# Altium project ControlBoard.PrjPcb (part 2 of 3)

## Sheet Analogicas_Tension.SchDoc: Analogicas Tension
size A3; CompanyName: TM; DrawnBy: Juan Tinazzo; Revision: R8; SheetNumber: 4; SheetTotal: 7; Number: CB_AT; Company: TM
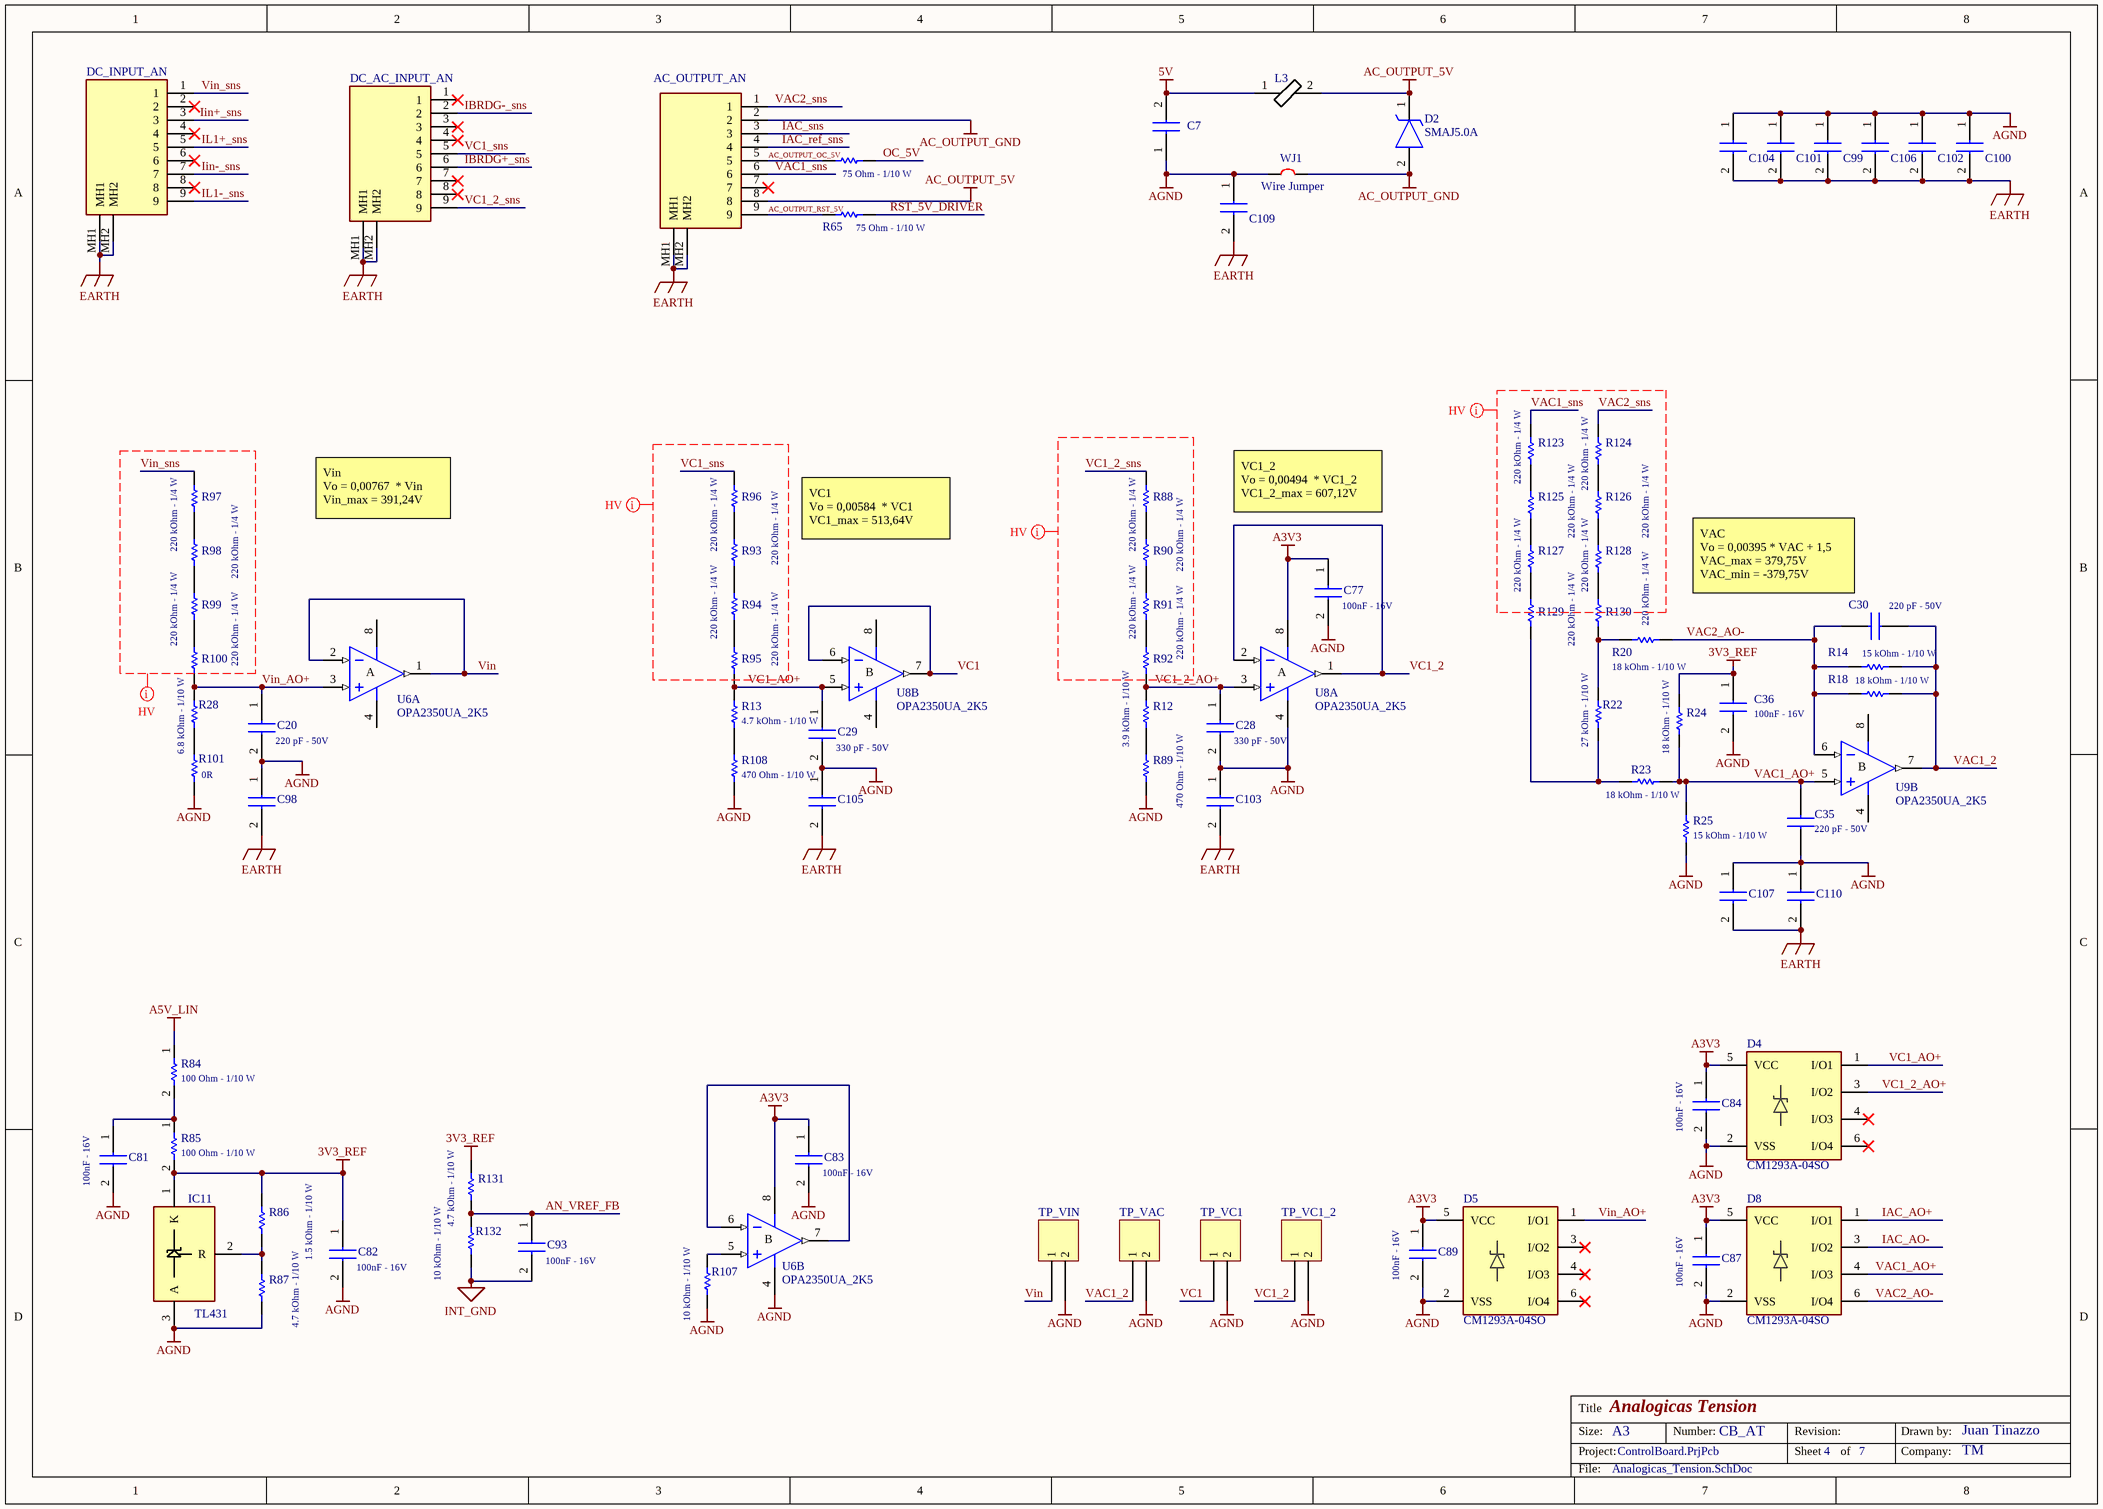
[diagram p3: Analogicas_Tension.SchDoc]

### Parts
AC_OUTPUT_AN  L77TSEH09SOL2RM8  [L77TSEH09SOL2RM8]  (value not drawn)
C7  CL21B105KAFNNNG  [CAPC2012X135N]  (value not drawn)
C20  value 220 pF - 50V  [C0603]  (hidden comment: 220p 50V 5% 0603)
C28  value 330 pF - 50V  [C0603]  (hidden comment: C0603C331J5GACAUTO)
C29  value 330 pF - 50V  [C0603]  (hidden comment: C0603C331J5GACAUTO)
C30  value 220 pF - 50V  [C0603]  (hidden comment: C0603C221J5HACAUTO)
C35  value 220 pF - 50V  [C0603]  (hidden comment: C0603C221J5HACAUTO)
C36  value 100nF - 16V  [CAPC1608X95N]  (hidden comment: 100n 16V 0603)
C77  value 100nF - 16V  [CAPC1608X95N]  (hidden comment: 100n 16V 0603)
C81  value 100nF - 16V  [CAPC1608X95N]  (hidden comment: 100n 16V 0603)
C82  value 100nF - 16V  [CAPC1608X95N]  (hidden comment: 100n 16V 0603)
C83  value 100nF - 16V  [CAPC1608X95N]  (hidden comment: 100n 16V 0603)
C84  value 100nF - 16V  [CAPC1608X95N]  (hidden comment: 100n 16V 0603)
C87  value 100nF - 16V  [CAPC1608X95N]  (hidden comment: 100n 16V 0603)
C89  value 100nF - 16V  [CAPC1608X95N]  (hidden comment: 100n 16V 0603)
C93  value 100nF - 16V  [CAPC1608X95N]  (hidden comment: 100n 16V 0603)
C98  LDEQD1100KA5N00  [C_2220_1206]  (value not drawn)
C99  C1206C102KGRACAUTO  [C1206]  (value not drawn)
C100  C1206C102KGRACAUTO  [C1206]  (value not drawn)
C101  C1206C102KGRACAUTO  [C1206]  (value not drawn)
C102  C1206C102KGRACAUTO  [C1206]  (value not drawn)
C103  LDEQD1100KA5N00  [C_2220_1206]  (value not drawn)
C104  C1206C102KGRACAUTO  [C1206]  (value not drawn)
C105  LDEQD1100KA5N00  [C_2220_1206]  (value not drawn)
C106  C1206C102KGRACAUTO  [C1206]  (value not drawn)
C107  LDEQD1100KA5N00  [C_2220_1206]  (value not drawn)
C109  LDEQD1100KA5N00  [C_2220_1206]  (value not drawn)
C110  LDEQD1100KA5N00  [C_2220_1206]  (value not drawn)
D2  SMAJ5.0A  [DIOM5026X229N]
D4  CM1293A-04SO  [SOT95P275X110-6N]
D5  CM1293A-04SO  [SOT95P275X110-6N]
D8  CM1293A-04SO  [SOT95P275X110-6N]
DC_AC_INPUT_AN  L77TSEH09SOL2RM8  [L77TSEH09SOL2RM8]  (value not drawn)
DC_INPUT_AN  L77TSEH09SOL2RM8  [L77TSEH09SOL2RM8]  (value not drawn)
IC11  TL431  [SOT95P237X112-3N]
L3  78279220601  [BEADC2012X110N]  (value not drawn)
R12  value 3.9 kOhm - 1/10 W  [RESC1608X50N]  (hidden comment: CRCW06033K90FKEA)
R13  value 4.7 kOhm - 1/10 W  [RESC1608X50N]  (hidden comment: CRCW06034K70FKEAHP)
R14  value 15 kOhm - 1/10 W  [RESC1608X55N]  (hidden comment: CRCW060315K0FKEAC)
R18  value 18 kOhm - 1/10 W  [RESC1608X50N]  (hidden comment: CRCW060318K0FKEA)
R20  value 18 kOhm - 1/10 W  [RESC1608X50N]  (hidden comment: CRCW060318K0FKEA)
R22  value 27 kOhm - 1/10 W  [RESC1608X55N]  (hidden comment: CRCW060327K0FKEAC)
R23  value 18 kOhm - 1/10 W  [RESC1608X50N]  (hidden comment: CRCW060318K0FKEA)
R24  value 18 kOhm - 1/10 W  [RESC1608X50N]  (hidden comment: CRCW060318K0FKEA)
R25  value 15 kOhm - 1/10 W  [RESC1608X55N]  (hidden comment: CRCW060315K0FKEAC)
R28  value 6.8 kOhm - 1/10 W  [RESC1608X50N]  (hidden comment: CRCW06036K80FKEA)
R62  value 75 Ohm - 1/10 W  [RESC1608X55N]  (hidden comment: CRCW060375R0FKEAC)
R65  value 75 Ohm - 1/10 W  [RESC1608X55N]  (hidden comment: CRCW060375R0FKEAC)
R84  value 100 Ohm - 1/10 W  [RESC1608X55N]  (hidden comment: CRCW0603100RFKEBC)
R85  value 100 Ohm - 1/10 W  [RESC1608X55N]  (hidden comment: CRCW0603100RFKEBC)
R86  value 1.5 kOhm - 1/10 W  [RESC1608X50N]  (hidden comment: CRCW06031K50FKEA)
R87  value 4.7 kOhm - 1/10 W  [RESC1608X50N]  (hidden comment: CRCW06034K70FKEAHP)
R88  value 220 kOhm - 1/4 W  [RESC3216X60N]  (hidden comment: CRCW1206220KFKEA)
R89  value 470 Ohm - 1/10 W  [RESC1608X50N]  (hidden comment: CRCW0603470RFKEA)
R90  value 220 kOhm - 1/4 W  [RESC3216X60N]  (hidden comment: CRCW1206220KFKEA)
R91  value 220 kOhm - 1/4 W  [RESC3216X60N]  (hidden comment: CRCW1206220KFKEA)
R92  value 220 kOhm - 1/4 W  [RESC3216X60N]  (hidden comment: CRCW1206220KFKEA)
R93  value 220 kOhm - 1/4 W  [RESC3216X60N]  (hidden comment: CRCW1206220KFKEA)
R94  value 220 kOhm - 1/4 W  [RESC3216X60N]  (hidden comment: CRCW1206220KFKEA)
R95  value 220 kOhm - 1/4 W  [RESC3216X60N]  (hidden comment: CRCW1206220KFKEA)
R96  value 220 kOhm - 1/4 W  [RESC3216X60N]  (hidden comment: CRCW1206220KFKEA)
R97  value 220 kOhm - 1/4 W  [RESC3216X60N]  (hidden comment: CRCW1206220KFKEA)
R98  value 220 kOhm - 1/4 W  [RESC3216X60N]  (hidden comment: CRCW1206220KFKEA)
R99  value 220 kOhm - 1/4 W  [RESC3216X60N]  (hidden comment: CRCW1206220KFKEA)
R100  value 220 kOhm - 1/4 W  [RESC3216X60N]  (hidden comment: CRCW1206220KFKEA)
R101  value 0R  [RESC1608X55N]  (hidden comment: CRCW06030000Z0EBC)
R107  value 10 kOhm - 1/10 W  [RESC1608X50N]  (hidden comment: CRCW060310K0FKEA)
R108  value 470 Ohm - 1/10 W  [RESC1608X50N]  (hidden comment: CRCW0603470RFKEA)
R123  value 220 kOhm - 1/4 W  [RESC3216X60N]  (hidden comment: CRCW1206220KFKEA)
R124  value 220 kOhm - 1/4 W  [RESC3216X60N]  (hidden comment: CRCW1206220KFKEA)
R125  value 220 kOhm - 1/4 W  [RESC3216X60N]  (hidden comment: CRCW1206220KFKEA)
R126  value 220 kOhm - 1/4 W  [RESC3216X60N]  (hidden comment: CRCW1206220KFKEA)
R127  value 220 kOhm - 1/4 W  [RESC3216X60N]  (hidden comment: CRCW1206220KFKEA)
R128  value 220 kOhm - 1/4 W  [RESC3216X60N]  (hidden comment: CRCW1206220KFKEA)
R129  value 220 kOhm - 1/4 W  [RESC3216X60N]  (hidden comment: CRCW1206220KFKEA)
R130  value 220 kOhm - 1/4 W  [RESC3216X60N]  (hidden comment: CRCW1206220KFKEA)
R131  value 4.7 kOhm - 1/10 W  [RESC1608X50N]  (hidden comment: CRCW06034K70FKEAHP)
R132  value 10 kOhm - 1/10 W  [RESC1608X50N]  (hidden comment: CRCW060310K0FKEA)
TP_VAC  Test_Point  [Test Point]  (value not drawn)
TP_VC1  Test_Point  [Test Point]  (value not drawn)
TP_VC1_2  Test_Point  [Test Point]  (value not drawn)
TP_VIN  Test_Point  [Test Point]  (value not drawn)
U6  OPA2350UA_2K5  [SOIC127P600X175-8N]  (parts A,B of 2)
U8  OPA2350UA_2K5  [SOIC127P600X175-8N]  (parts A,B of 2)
U9  OPA2350UA_2K5  [SOIC127P600X175-8N]  (part B of 2)
WJ1  Wire Jumper  (net tie, no BOM)

### Nets
3V3_REF: C36.1 C82.1 IC11.1(K) R24.2 R85.2 R86.1 R131.1
5V: C7.2 L3.1
A3V3: C77.1 C83.1 C84.1 C87.1 C89.1 D4.5(VCC) D5.5(VCC) D8.5(VCC) U6.8(V+) U8.8(V+) U9.8(V+)
A5V_LIN: R84.1
AC_OUTPUT_5V: AC_OUTPUT_AN.8 D2.1(K) L3.2
AC_OUTPUT_GND: AC_OUTPUT_AN.2 D2.2(A) WJ1.1
AGND: C7.1 C20.2 C28.2 C29.2 C35.2 C36.2 C77.2 C81.2 C82.2 C83.2 C84.2 C87.2 C89.2 C93.2 C98.1 C99.1 C100.1 C101.1 C102.1 C103.1 C104.1 C105.1 C106.1 C107.1 C109.1 C110.1 D4.2(VSS) D5.2(VSS) D8.2(VSS) IC11.3(A) R25.2 R87.2 R89.2 R101.1 R107.1 R108.2 R132.2 TP_VAC.2 TP_VC1.2 TP_VC1_2.2 TP_VIN.2 U6.4(V-) U8.4(V-) U9.4(V-) WJ1.0  [also labelled INT_GND]
EARTH: AC_OUTPUT_AN.MH1 AC_OUTPUT_AN.MH2 C98.2 C99.2 C100.2 C101.2 C102.2 C103.2 C104.2 C105.2 C106.2 C107.2 C109.2 C110.2 DC_AC_INPUT_AN.MH1 DC_AC_INPUT_AN.MH2 DC_INPUT_AN.MH1 DC_INPUT_AN.MH2
AC_OUTPUT_OC_5V: AC_OUTPUT_AN.5 R62.1
AC_OUTPUT_RST_5V: AC_OUTPUT_AN.9 R65.1
AN_VREF_FB: C93.1 R131.2 R132.1
IAC_AO+: D8.1(I/O1)
IAC_AO-: D8.3(I/O2)
IAC_ref_sns: AC_OUTPUT_AN.4
IAC_sns: AC_OUTPUT_AN.3
IBRDG+_sns: DC_AC_INPUT_AN.6
IBRDG-_sns: DC_AC_INPUT_AN.2
Iin+_sns: DC_INPUT_AN.3
Iin-_sns: DC_INPUT_AN.7
IL1+_sns: DC_INPUT_AN.5
IL1-_sns: DC_INPUT_AN.9
OC_5V: R62.2
RST_5V_DRIVER: R65.2
VAC1_2: C30.1 R14.2 R18.2 TP_VAC.1 U9.7(OUT)
VAC1_AO+: C35.1 D8.4(I/O3) R23.1 R24.1 R25.1 U9.5(IN+)
VAC1_sns: AC_OUTPUT_AN.6 R123.2
VAC2_AO-: C30.2 D8.6(I/O4) R14.1 R18.1 R20.1 U9.6(IN-)
VAC2_sns: AC_OUTPUT_AN.1 R124.2
VC1: TP_VC1.1 U8.6(IN-) U8.7(OUT)
VC1_2: TP_VC1_2.1 U8.1(OUT) U8.2(IN-)
VC1_2_AO+: C28.1 D4.3(I/O2) R12.2 R92.1 U8.3(IN+)
VC1_2_sns: DC_AC_INPUT_AN.9 R88.2
VC1_AO+: C29.1 D4.1(I/O1) R13.2 R95.1 U8.5(IN+)
VC1_sns: DC_AC_INPUT_AN.5 R96.2
Vin: TP_VIN.1 U6.1(OUT) U6.2(IN-)
Vin_AO+: C20.1 D5.1(I/O1) R28.2 R100.1 U6.3(IN+)
Vin_sns: DC_INPUT_AN.1 R97.2
NetC81_1: C81.1 R84.2 R85.1
NetIC11_2: IC11.2(R) R86.2 R87.1
NetR12_1: R12.1 R89.1
NetR13_1: R13.1 R108.1
NetR20_2: R20.2 R22.2 R130.1
NetR22_1: R22.1 R23.2 R129.1
NetR28_1: R28.1 R101.2
NetR88_1: R88.1 R90.2
NetR90_1: R90.1 R91.2
NetR91_1: R91.1 R92.2
NetR93_1: R93.1 R94.2
NetR93_2: R93.2 R96.1
NetR94_1: R94.1 R95.2
NetR97_1: R97.1 R98.2
NetR98_1: R98.1 R99.2
NetR99_1: R99.1 R100.2
NetR107_2: R107.2 U6.5(IN+)
NetR123_1: R123.1 R125.2
NetR124_1: R124.1 R126.2
NetR125_1: R125.1 R127.2
NetR126_1: R126.1 R128.2
NetR127_1: R127.1 R129.2
NetR128_1: R128.1 R130.2
NetU6_6: U6.6(IN-) U6.7(OUT)

Not connected (* = marked no-connect by the designer): AC_OUTPUT_AN 7*; D4 4(I/O3)* 6(I/O4)*; D5 3(I/O2)* 4(I/O3)* 6(I/O4)*; DC_AC_INPUT_AN 1* 3* 4* 7* 8*; DC_INPUT_AN 2* 4* 6* 8*

### Layout directives
net class HV_track: VAC1_sns, VAC2_sns, VC1_2_sns, VC1_sns, Vin_sns

### Notes on the sheet
- Vin
  Vo = 0,00767  * Vin
  Vin_max = 391,24V
- VC1_2
  Vo = 0,00494  * VC1_2
  VC1_2_max = 607,12V
- VC1
  Vo = 0,00584  * VC1
  VC1_max = 513,64V
- VAC
  Vo = 0,00395 * VAC + 1,5
  VAC_max = 379,75V
  VAC_min = -379,75V
- Title
- Size:
- Project:
- A3
- Number:
- Revision:
- Sheet
- of
- Drawn by:
- Company:
- File:
- (in symbol OPA2350UA_2K5, part A) A
- (in symbol OPA2350UA_2K5, part B) B

### Library data of the parts
AC_OUTPUT_AN DC_AC_INPUT_AN DC_INPUT_AN = L77TSEH09SOL2RM8: Connector; Manufacturer_Name: Amphenol Communications Solutions; Value: Conectores estándar subminiatura D D-SUB; Datasheet Link: https://cdn.amphenol-cs.com/media/wysiwyg/files/drawing/l77tsxhxxsol2rm8.pdf; Height: 12.3mm; Manufacturer_Part_Number: L77TSEH09SOL2RM8; Mouser Part Number: 523-L77TSEH09SOL2RM8; Mouser Price/Stock: https://www.mouser.co.uk/ProductDetail/Amphenol-Commercial-Products/L77TSEH09SOL2RM8?qs=mq7kV%2Fq8lk5RvjourI%2Fduw%3D%3D; Arrow Part Number: L77TSEH09SOL2RM8; Arrow Price/Stock: https://www.arrow.com/en/products/l77tseh09sol2rm8/amphenol-fci?region=nac; System: Connector
C7 = CL21B105KAFNNNG: Capacitor; Manufacturer_Name: SAMSUNG; Value: 1 uF - 25 V; Datasheet Link: https://datasheet.datasheetarchive.com/originals/distributors/Datasheets-DGA8/2478773.pdf; Height: 1.35mm; Manufacturer_Part_Number: CL21B105KAFNNNG; Mouser Part Number: 187-CL21B105KAFNNNG; Mouser Price/Stock: https://www.mouser.co.uk/ProductDetail/Samsung-Electro-Mechanics/CL21B105KAFNNNG?qs=yOVawPpwOwmXkU%252BG0TK%2F5g%3D%3D; Arrow Part Number: CL21B105KAFNNNG; Arrow Price/Stock: https://www.arrow.com/en/products/cl21b105kafnnng/samsung-electro-mechanics?region=europe
C20 C30 C35 = C0603C221J5HACAUTO: Capacitor; Manufacturer_Name: KEMET; Datasheet Link: https://content.kemet.com/datasheets/KEM_C1007_X8R_ULTRA_150C_SMD.pdf; Height: 0.87mm; Manufacturer_Part_Number: C0603C221J5HACAUTO; Mouser Part Number: 80-C0603C221J5HAUTO; Mouser Price/Stock: https://www.mouser.co.uk/ProductDetail/KEMET/C0603C221J5HACAUTO?qs=j%252B1pi9TdxUZayjzZ3rh80g%3D%3D
C28 C29 = C0603C331J5GACAUTO: Capacitor; Manufacturer_Name: KEMET; Datasheet Link: https://content.kemet.com/datasheets/KEM_C1022_C0G_AUTO_SMD.pdf; Height: 0.87mm; Manufacturer_Part_Number: C0603C331J5GACAUTO; Mouser Part Number: 80-C0603C331J5GAUTO
C36 C77 C81-C84 C87 C89 C93 = EMK107B7104KA-T: Capacitor; Manufacturer_Name: TAIYO YUDEN; Datasheet Link: http://www.farnell.com/datasheets/746258.pdf; Height: 0.95mm; Manufacturer_Part_Number: EMK107B7104KA-T; Mouser Part Number: 963-EMK107B7104KA-T; Arrow Part Number: EMK107B7104KA-T; Arrow Price/Stock: https://www.arrow.com/en/products/emk107b7104ka-t/taiyo-yuden
  C36: Mouser Price/Stock: https://www.mouser.co.uk/ProductDetail/TAIYO-YUDEN/EMK107B7104KA-T?qs=I6KAKw0tg2ybqzX8hKPgfw%3D%3D
  C77 C81-C84 C87 C89 C93: Mouser Price/Stock: https://www.mouser.co.uk/ProductDetail/Taiyo-Yuden/EMK107B7104KA-T?qs=I6KAKw0tg2ybqzX8hKPgfw%3D%3D
C98 C103 C105 C107 C109 C110 = LDEQD1100KA5N00: Capacitor; Manufacturer_Name: KEMET; Value: 1nF - 1000V; Datasheet Link: https://content.kemet.com/datasheets/KEM_F3078_LDE.pdf; Height: 1.9mm; Manufacturer_Part_Number: LDEQD1100KA5N00; Mouser Part Number: 80-LDEQD1100KA5N00; Mouser Price/Stock: https://www.mouser.co.uk/ProductDetail/KEMET/LDEQD1100KA5N00?qs=MdJgNetHbfkxq2yA6XdGCw%3D%3D
C99-C102 C104 C106 = C1206C102KGRACAUTO: Capacitor; Manufacturer_Name: KEMET; Value: 1nF - 2000V; Datasheet Link: https://content.kemet.com/datasheets/KEM_C1076_X7R_HV_AUTO_SMD.pdf; Manufacturer_Part_Number: C1206C102KGRACAUTO; Mouser Part Number: 80-C1206C102KGRAUTO; Mouser Price/Stock: https://www.mouser.co.uk/ProductDetail/KEMET/C1206C102KGRACAUTO?qs=02kMkzikyGKenJNcwYLRQw%3D%3D; Arrow Part Number: C1206C102KGRACAUTO; Arrow Price/Stock: https://www.arrow.com/en/products/c1206c102kgracauto/kemet-corporation?region=nac
D2 = SMAJ5.0A: TVS Diode (Uni-directional); Manufacturer_Name: LITTELFUSE; Value: 1CH - Unidireccional - 5V - 3.3 W; Datasheet Link: https://www.littelfuse.com/~/media/electronics/datasheets/tvs_diodes/littelfuse_tvs_diode_smaj_datasheet.pdf.pdf; Height: 2.29mm; Manufacturer_Part_Number: SMAJ5.0A; Mouser Part Number: 576-SMAJ5.0A; Mouser Price/Stock: https://www.mouser.co.uk/ProductDetail/Littelfuse/SMAJ5.0A?qs=2VFNtWizgicfetZVA4gWHA%3D%3D; Arrow Part Number: SMAJ5.0A; Arrow Price/Stock: https://www.arrow.com/en/products/smaj5.0a/littelfuse?region=europe
D4 D5 D8 = CM1293A-04SO: TVS Diode (Bi-directional); Manufacturer_Name: onsemi; Manufacturer_Part_Number: D5V0P4UR6SO-7; Value: 4CH - Unidireccional - 3.3V - 800mW; Datasheet Link: https://www.onsemi.com/pub/Collateral/CM1293A-04SO-D.PDF; Height: 1.1mm; Mouser Part Number: 748-CM1293A-04SO; Mouser Price/Stock: https://www.mouser.co.uk/ProductDetail/onsemi/CM1293A-04SO?qs=LMMkZCEv%2Ff0mlcOKTEwKBg%3D%3D; Arrow Part Number: CM1293A-04SO; Arrow Price/Stock: https://www.arrow.com/en/products/cm1293a-04so/on-semiconductor?region=nac
IC11 = TL431LIBEDBZRQ1: Integrated Circuit; Manufacturer_Name: Texas Instruments; Value: Referencias de voltaje; Datasheet Link: https://www.ti.com/lit/gpn/TL431LI-Q1; Height: 1.12mm; Manufacturer_Part_Number: TL431LIBEDBZRQ1; Mouser Part Number: 595-TL431LIBEDBZRQ1; Mouser Price/Stock: https://www.mouser.co.uk/ProductDetail/Texas-Instruments/TL431LIBEDBZRQ1?qs=Cb2nCFKsA8oDEduucTTYNA%3D%3D; Arrow Part Number: TL431LIBEDBZRQ1; Arrow Price/Stock: https://www.arrow.com/en/products/tl431libedbzrq1/texas-instruments?region=nac
L3 = 78279220601: Ferrite Bead; Manufacturer_Name: Wurth Elektronik; Value: Núcleos de ferrita WE-MPSA EMI 600Ohms 2.1A 80mOhms; Datasheet Link: https://www.mouser.de/datasheet/2/445/78279220601-2298574.pdf; Height: 1.1mm; Manufacturer_Part_Number: 78279220601; Mouser Part Number: 710-78279220601; Mouser Price/Stock: https://www.mouser.co.uk/ProductDetail/Wurth-Elektronik/78279220601?qs=iLbezkQI%252BsjgiK1FovJqGg%3D%3D
R12 = CRCW06033K90FKEA: Resistor; Manufacturer_Name: Vishay; Datasheet Link: http://www.vishay.com/docs/20035/dcrcwe3.pdf; Height: 0.5mm; Manufacturer_Part_Number: CRCW06033K90FKEA; Mouser Part Number: 71-CRCW0603-3.9K-E3; Mouser Price/Stock: https://www.mouser.com/Search/Refine.aspx?Keyword=71-CRCW0603-3.9K-E3; Arrow Part Number: CRCW06033K90FKEA; Arrow Price/Stock: https://www.arrow.com/en/products/crcw06033k90fkea/vishay
R13 R87 R131 = CRCW06034K70FKEAHP: Resistor; Manufacturer_Name: Vishay; Datasheet Link: http://www.farnell.com/datasheets/1885357.pdf; Height: 0.5mm; Manufacturer_Part_Number: CRCW06034K70FKEAHP; Mouser Part Number: 71-CRCW06034K70FKEAH; Mouser Price/Stock: https://www.mouser.co.uk/ProductDetail/Vishay-Dale/CRCW06034K70FKEAHP?qs=k2%2FDWSARqgF9tclCHvhGkQ%3D%3D; Arrow Part Number: CRCW06034K70FKEAHP; Arrow Price/Stock: https://www.arrow.com/en/products/crcw06034k70fkeahp/vishay?region=nac
R14 R25 = CRCW060315K0FKEAC: Resistor; Manufacturer_Name: Vishay; Datasheet Link: https://www.arrow.com/en/products/crcw060315k0fkeac/vishay; Height: 0.55mm; Manufacturer_Part_Number: CRCW060315K0FKEAC; Mouser Part Number: 71-CRCW060315K0FKEAC; Mouser Price/Stock: https://www.mouser.co.uk/ProductDetail/Vishay-Dale/CRCW060315K0FKEAC?qs=E3Y5ESvWgWOCeZLgjE8pIw%3D%3D; Arrow Part Number: CRCW060315K0FKEAC; Arrow Price/Stock: https://www.arrow.com/en/products/crcw060315k0fkeac/vishay?region=nac
R18 R20 R23 R24 = CRCW060318K0FKEA: Resistor; Manufacturer_Name: Vishay; Datasheet Link: http://www.vishay.com/docs/20035/dcrcwe3.pdf; Height: 0.5mm; Manufacturer_Part_Number: CRCW060318K0FKEA; Mouser Part Number: 71-CRCW0603-18K-E3; Mouser Price/Stock: https://www.mouser.co.uk/ProductDetail/Vishay-Dale/CRCW060318K0FKEA?qs=Ihd9YkxhV%2F2Qiuqr%2FyuzaQ%3D%3D; Arrow Part Number: CRCW060318K0FKEA; Arrow Price/Stock: https://www.arrow.com/en/products/crcw060318k0fkea/vishay?region=nac
R22 = CRCW060327K0FKEAC: Resistor; Manufacturer_Name: Vishay; Datasheet Link: https://www.arrow.com/en/products/crcw060327k0fkeac/vishay; Height: 0.55mm; Manufacturer_Part_Number: CRCW060327K0FKEAC; Mouser Part Number: 71-CRCW060327K0FKEAC; Mouser Price/Stock: https://www.mouser.co.uk/ProductDetail/Vishay-Dale/CRCW060327K0FKEAC?qs=E3Y5ESvWgWP9bkV7w8gJXg%3D%3D; Arrow Part Number: CRCW060327K0FKEAC; Arrow Price/Stock: https://www.arrow.com/en/products/crcw060327k0fkeac/vishay?region=nac
R28 = CRCW06036K80FKEA: Resistor; Manufacturer_Name: Vishay; Datasheet Link: http://www.vishay.com/docs/20035/dcrcwe3.pdf; Height: 0.5mm; Manufacturer_Part_Number: CRCW06036K80FKEA; Mouser Part Number: 71-CRCW0603-6.8K-E3; Mouser Price/Stock: https://www.mouser.co.uk/ProductDetail/Vishay-Dale/CRCW06036K80FKEA?qs=AJ8X0UdFcuT%2FTCHOUTZCrw%3D%3D; Arrow Part Number: CRCW06036K80FKEA; Arrow Price/Stock: https://www.arrow.com/en/products/crcw06036k80fkea/vishay
R62 R65 = CRCW060375R0FKEAC: Resistor; Manufacturer_Name: Vishay; Datasheet Link: https://www.arrow.com/en/products/crcw060375r0fkeac/vishay; Height: 0.55mm; Manufacturer_Part_Number: CRCW060375R0FKEAC; Mouser Part Number: 71-CRCW060375R0FKEAC; Mouser Price/Stock: https://www.mouser.co.uk/ProductDetail/Vishay-Dale/CRCW060375R0FKEAC?qs=E3Y5ESvWgWPOxF9wqCfv4A%3D%3D; Arrow Part Number: CRCW060375R0FKEAC; Arrow Price/Stock: https://www.arrow.com/en/products/crcw060375r0fkeac/vishay?region=nac
R84 R85 = CRCW0603100RFKEBC: Resistor; Manufacturer_Name: Vishay; Datasheet Link: https://www.vishay.com/docs/28773/crcwce3.pdf; Height: 0.55mm; Manufacturer_Part_Number: CRCW0603100RFKEBC; Mouser Part Number: 71-CRCW0603100RFKEBC; Mouser Price/Stock: https://www.mouser.co.uk/ProductDetail/Vishay-Dale/CRCW0603100RFKEBC?qs=wd5RIQLrsJhdvQFtBw4oWg%3D%3D; Arrow Part Number: CRCW0603100RFKEBC; Arrow Price/Stock: https://www.arrow.com/en/products/crcw0603100rfkebc/vishay?region=nac
R86 = CRCW06031K50FKEA: Resistor; Manufacturer_Name: Vishay; Datasheet Link: http://www.vishay.com/docs/20035/dcrcwe3.pdf; Height: 0.5mm; Manufacturer_Part_Number: CRCW06031K50FKEA; Mouser Part Number: 71-CRCW0603-1.5K-E3; Mouser Price/Stock: https://www.mouser.co.uk/ProductDetail/Vishay-Dale/CRCW06031K50FKEA?qs=TPnjyyNsHsazZOiw0hmO4g%3D%3D; Arrow Part Number: CRCW06031K50FKEA; Arrow Price/Stock: https://www.arrow.com/en/products/crcw06031k50fkea/vishay?region=nac
R88 R90-R100 R123-R130 = CRCW1206220KFKEA: Resistor; Manufacturer_Name: Vishay; Datasheet Link: http://www.vishay.com/docs/20035/dcrcwe3.pdf; Height: 0.6mm; Manufacturer_Part_Number: CRCW1206220KFKEA; Mouser Part Number: 71-CRCW1206-220K-E3; Mouser Price/Stock: https://www.mouser.co.uk/ProductDetail/Vishay-Dale/CRCW1206220KFKEA?qs=bSMkur10BccuQYiNrhxgBA%3D%3D
R89 R108 = CRCW0603470RFKEA: Resistor; Manufacturer_Name: Vishay; Datasheet Link: http://www.vishay.com/docs/20035/dcrcwe3.pdf; Height: 0.5mm; Manufacturer_Part_Number: CRCW0603470RFKEA; Mouser Part Number: 71-CRCW0603-470-E3; Mouser Price/Stock: https://www.mouser.co.uk/ProductDetail/Vishay-Dale/CRCW0603470RFKEA?qs=2LLIXXYaQepTa3IToKeExA%3D%3D; Arrow Part Number: CRCW0603470RFKEA; Arrow Price/Stock: https://www.arrow.com/en/products/crcw0603470rfkea/vishay
R101 = CRCW06030000Z0EBC: Resistor; Manufacturer_Name: Vishay; Datasheet Link: https://datasheet.datasheetarchive.com/originals/distributors/DKDS41/DSANUWW0030149.pdf; Height: 0.55mm; Manufacturer_Part_Number: CRCW06030000Z0EBC; Mouser Part Number: 71-CRCW06030000Z0EBC; Mouser Price/Stock: https://www.mouser.co.uk/ProductDetail/Vishay-Dale/CRCW06030000Z0EBC?qs=wd5RIQLrsJgQzOqdcVum5Q%3D%3D; Arrow Part Number: CRCW06030000Z0EBC; Arrow Price/Stock: https://www.arrow.com/en/products/crcw06030000z0ebc/vishay?region=nac
R107 R132 = CRCW060310K0FKEA: Resistor; Manufacturer_Name: Vishay; Datasheet Link: http://www.vishay.com/docs/20035/dcrcwe3.pdf; Height: 0.5mm; Manufacturer_Part_Number: CRCW060310K0FKEA; Mouser Part Number: 71-CRCW0603-10K-E3; Mouser Price/Stock: https://www.mouser.co.uk/ProductDetail/Vishay-Dale/CRCW060310K0FKEA?qs=pAO1Z172M84BVnhDjtnsoQ%3D%3D; Arrow Part Number: CRCW060310K0FKEA; Arrow Price/Stock: https://www.arrow.com/en/products/crcw060310k0fkea/vishay?region=nac
TP_VAC TP_VC1 TP_VC1_2 TP_VIN = Test_Point: Punta Prueba Osciloscopio; Manufacturer_Part_Number: PCB; Value: TP
U6 U8 U9 = OPA2350UA_2K5: Integrated Circuit; Manufacturer_Name: Texas Instruments; Manufacturer_Part_Number: OPA2350UA/2K5; Value: AO de alta velocidad, fuente unica, rail to rail; Datasheet Link: http://www.ti.com/lit/gpn/opa2350; Height: 1.75mm; Mouser Part Number: 595-OPA2350UA/2K5; Mouser Price/Stock: https://www.mouser.co.uk/ProductDetail/Texas-Instruments/OPA2350UA-2K5?qs=7nS3%252BbEUL6t75JUF5jEhbw%3D%3D; Arrow Part Number: OPA2350UA/2K5; Arrow Price/Stock: https://www.arrow.com/en/products/opa2350ua2k5/texas-instruments?region=nac
WJ1 = Wire Jumper: Manufacturer_Part_Number: Wire

## Sheet Analogicas_Corriente.SchDoc: Analogicas Corriente
size A3; CompanyName: TM; DrawnBy: Juan Tinazzo; Revision: R8; SheetNumber: 5; SheetTotal: 7; Number: CB_AC; Company: TM
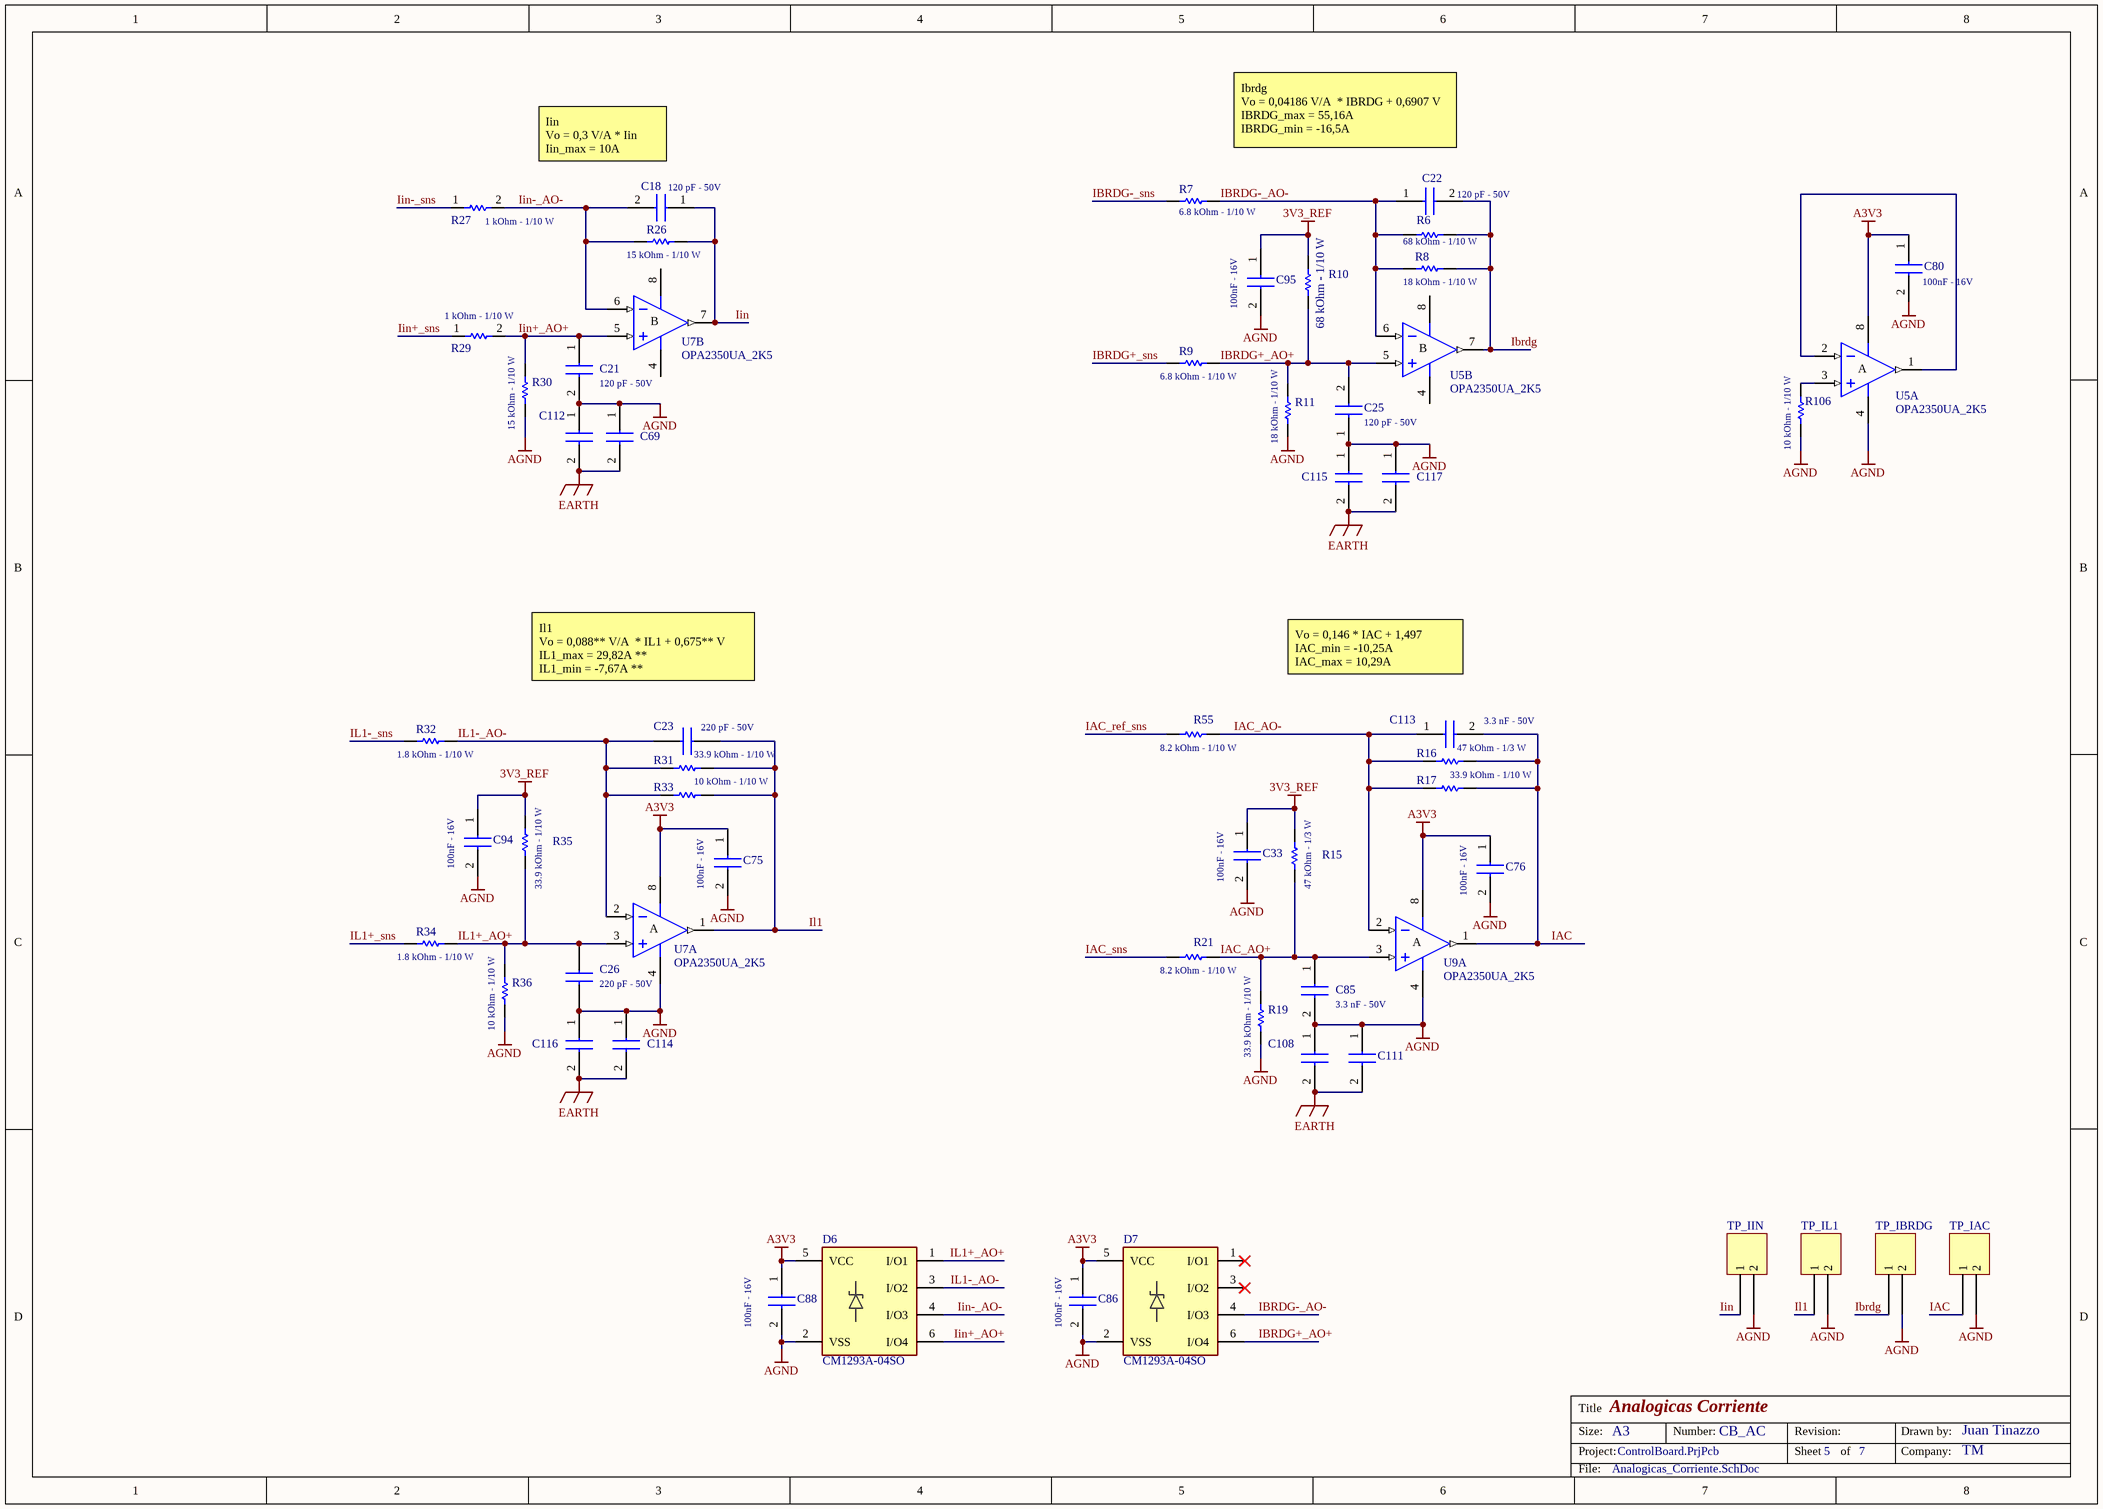
[diagram p4: Analogicas_Corriente.SchDoc]

### Parts
C18  value 120 pF - 50V  [C0603]  (hidden comment: 120p)
C21  value 120 pF - 50V  [C0603]  (hidden comment: C0603C121J5GAC7411)
C22  value 120 pF - 50V  [C0603]  (hidden comment: C0603C121J5GAC7411)
C23  value 220 pF - 50V  [C0603]  (hidden comment: 220p)
C25  value 120 pF - 50V  [C0603]  (hidden comment: C0603C121J5GAC7411)
C26  value 220 pF - 50V  [C0603]  (hidden comment: 220p)
C33  value 100nF - 16V  [CAPC1608X95N]  (hidden comment: 100n 16V 0603)
C69  C1206C102KGRACAUTO  [C1206]  (value not drawn)
C75  value 100nF - 16V  [CAPC1608X95N]  (hidden comment: 100n 16V 0603)
C76  value 100nF - 16V  [CAPC1608X95N]  (hidden comment: 100n 16V 0603)
C80  value 100nF - 16V  [CAPC1608X95N]  (hidden comment: 100n 16V 0603)
C85  value 3.3 nF - 50V  [C0603]  (hidden comment: C0603C121J5GAC7411)
C86  value 100nF - 16V  [CAPC1608X95N]  (hidden comment: 100n 16V 0603)
C88  value 100nF - 16V  [CAPC1608X95N]  (hidden comment: 100n 16V 0603)
C94  value 100nF - 16V  [CAPC1608X95N]  (hidden comment: 100n 16V 0603)
C95  value 100nF - 16V  [CAPC1608X95N]  (hidden comment: 100n 16V 0603)
C108  LDEQD1100KA5N00  [C_2220_1206]  (value not drawn)
C111  LDEQD1100KA5N00  [C_2220_1206]  (value not drawn)
C112  C1206C102KGRACAUTO  [C1206]  (value not drawn)
C113  value 3.3 nF - 50V  [C0603]  (hidden comment: C0603C121J5GAC7411)
C114  C1206C102KGRACAUTO  [C1206]  (value not drawn)
C115  C1206C102KGRACAUTO  [C1206]  (value not drawn)
C116  C1206C102KGRACAUTO  [C1206]  (value not drawn)
C117  C1206C102KGRACAUTO  [C1206]  (value not drawn)
D6  CM1293A-04SO  [SOT95P275X110-6N]
D7  CM1293A-04SO  [SOT95P275X110-6N]
R6  value 68 kOhm - 1/10 W  [RESC1608X55N]  (hidden comment: 68k)
R7  value 6.8 kOhm - 1/10 W  [RESC1608X50N]  (hidden comment: CRCW06036K80FKEA)
R8  value 18 kOhm - 1/10 W  [RESC1608X50N]  (hidden comment: CRCW060318K0FKEA)
R9  value 6.8 kOhm - 1/10 W  [RESC1608X50N]  (hidden comment: CRCW06036K80FKEA)
R10  68 kOhm - 1/10 W  [RESC1608X55N]
R11  value 18 kOhm - 1/10 W  [RESC1608X50N]  (hidden comment: CRCW060318K0FKEA)
R15  value 47 kOhm - 1/3 W  [RESC1608X50N]  (hidden comment: 47k)
R16  value 47 kOhm - 1/3 W  [RESC1608X50N]  (hidden comment: 47k)
R17  value 33.9 kOhm - 1/10 W  [RESC1608X50N]  (hidden comment: CRCW060339K0FKEA)
R19  value 33.9 kOhm - 1/10 W  [RESC1608X50N]  (hidden comment: CRCW060339K0FKEA)
R21  value 8.2 kOhm - 1/10 W  [RESC1608X55N]  (hidden comment: 8k2)
R26  value 15 kOhm - 1/10 W  [RESC1608X55N]  (hidden comment: CRCW060315K0FKEAC)
R27  value 1 kOhm - 1/10 W  [RESC1608X55N]  (hidden comment: CRCW06031K00FKEAC)
R29  value 1 kOhm - 1/10 W  [RESC1608X55N]  (hidden comment: CRCW06031K00FKEAC)
R30  value 15 kOhm - 1/10 W  [RESC1608X55N]  (hidden comment: CRCW060315K0FKEAC)
R31  value 33.9 kOhm - 1/10 W  [RESC1608X50N]  (hidden comment: CRCW060339K0FKEA)
R32  value 1.8 kOhm - 1/10 W  [RESC1608X55N]  (hidden comment: CRCW06031K80FKEAC)
R33  value 10 kOhm - 1/10 W  [RESC1608X50N]  (hidden comment: CRCW060310K0FKEA)
R34  value 1.8 kOhm - 1/10 W  [RESC1608X55N]  (hidden comment: CRCW06031K80FKEAC)
R35  value 33.9 kOhm - 1/10 W  [RESC1608X50N]  (hidden comment: CRCW060339K0FKEA)
R36  value 10 kOhm - 1/10 W  [RESC1608X50N]  (hidden comment: CRCW060310K0FKEA)
R55  value 8.2 kOhm - 1/10 W  [RESC1608X55N]  (hidden comment: 8k2)
R106  value 10 kOhm - 1/10 W  [RESC1608X50N]  (hidden comment: CRCW060310K0FKEA)
TP_IAC  Test_Point  [Test Point]  (value not drawn)
TP_IBRDG  Test_Point  [Test Point]  (value not drawn)
TP_IIN  Test_Point  [Test Point]  (value not drawn)
TP_IL1  Test_Point  [Test Point]  (value not drawn)
U5  OPA2350UA_2K5  [SOIC127P600X175-8N]  (parts A,B of 2)
U7  OPA2350UA_2K5  [SOIC127P600X175-8N]  (parts A,B of 2)
U9  OPA2350UA_2K5  [SOIC127P600X175-8N]  (part A of 2)

### Nets
3V3_REF: C33.1 C94.1 C95.1 R10.2 R15.2 R35.2
A3V3: C75.1 C76.1 C80.1 C86.1 C88.1 D6.5(VCC) D7.5(VCC) U5.8(V+) U7.8(V+) U9.8(V+)
AGND: C21.2 C25.1 C26.1 C33.2 C69.1 C75.2 C76.2 C80.2 C85.2 C86.2 C88.2 C94.2 C95.2 C108.1 C111.1 C112.1 C114.1 C115.1 C116.1 C117.1 D6.2(VSS) D7.2(VSS) R11.1 R19.1 R30.1 R36.2 R106.1 TP_IAC.2 TP_IBRDG.2 TP_IIN.2 TP_IL1.2 U5.4(V-) U7.4(V-) U9.4(V-)
EARTH: C69.2 C108.2 C111.2 C112.2 C114.2 C115.2 C116.2 C117.2
IAC: C113.2 R16.1 R17.1 TP_IAC.1 U9.1(OUT)
IAC_AO+: C85.1 R15.1 R19.2 R21.2 U9.3(IN+)
IAC_AO-: C113.1 R16.2 R17.2 R55.2 U9.2(IN-)
IAC_ref_sns: R55.1
IAC_sns: R21.1
Ibrdg: C22.2 R6.1 R8.1 TP_IBRDG.1 U5.7(OUT)
IBRDG+_AO+: C25.2 D7.6(I/O4) R9.1 R10.1 R11.2 U5.5(IN+)
IBRDG+_sns: R9.2
IBRDG-_AO-: C22.1 D7.4(I/O3) R6.2 R7.1 R8.2 U5.6(IN-)
IBRDG-_sns: R7.2
Iin: C18.1 R26.1 TP_IIN.1 U7.7(OUT)
Iin+_AO+: C21.1 D6.6(I/O4) R29.2 R30.2 U7.5(IN+)
Iin+_sns: R29.1
Iin-_AO-: C18.2 D6.4(I/O3) R26.2 R27.2 U7.6(IN-)
Iin-_sns: R27.1
Il1: C23.2 R31.1 R33.1 TP_IL1.1 U7.1(OUT)
IL1+_AO+: C26.2 D6.1(I/O1) R34.1 R35.1 R36.1 U7.3(IN+)
IL1+_sns: R34.2
IL1-_AO-: C23.1 D6.3(I/O2) R31.2 R32.1 R33.2 U7.2(IN-)
IL1-_sns: R32.2
NetR106_2: R106.2 U5.3(IN+)
NetU5_1: U5.1(OUT) U5.2(IN-)

Not connected (* = marked no-connect by the designer): D7 1(I/O1)* 3(I/O2)*

### Notes on the sheet
- Iin
  Vo = 0,3 V/A * Iin
  Iin_max = 10A
- Ibrdg
  Vo = 0,04186 V/A  * IBRDG + 0,6907 V
  IBRDG_max = 55,16A
  IBRDG_min = -16,5A
- Il1
  Vo = 0,088** V/A  * IL1 + 0,675** V
  IL1_max = 29,82A **
  IL1_min = -7,67A **
- Vo = 0,146 * IAC + 1,497
  IAC_min = -10,25A
  IAC_max = 10,29A
- Title
- Size:
- Project:
- A3
- Number:
- Revision:
- Sheet
- of
- Drawn by:
- Company:
- File:
- (in symbol OPA2350UA_2K5, part A) A
- (in symbol OPA2350UA_2K5, part B) B

### Library data of the parts
C18 C21 C22 C25 C85 C113 = C0603C121J5GAC7411: Capacitor; Manufacturer_Name: KEMET; Datasheet Link: https://content.kemet.com/datasheets/KEM_C1003_C0G_SMD.pdf; Height: 0.87mm; Manufacturer_Part_Number: C0603C121J5GAC7411; Mouser Part Number: 80-C0603C121J5GACLR; Mouser Price/Stock: https://www.mouser.co.uk/ProductDetail/KEMET/C0603C121J5GAC7411?qs=jZv2EoxFq37MWDKazt2ZvQ%3D%3D
C23 C26 = C0603C221J5HACAUTO: Capacitor; Manufacturer_Name: KEMET; Datasheet Link: https://content.kemet.com/datasheets/KEM_C1007_X8R_ULTRA_150C_SMD.pdf; Height: 0.87mm; Manufacturer_Part_Number: C0603C221J5HACAUTO; Mouser Part Number: 80-C0603C221J5HAUTO; Mouser Price/Stock: https://www.mouser.co.uk/ProductDetail/KEMET/C0603C221J5HACAUTO?qs=j%252B1pi9TdxUZayjzZ3rh80g%3D%3D
C33 C75 C76 C80 C86 C88 C94 C95 = EMK107B7104KA-T: as C36 on sheet Analogicas_Tension; Datasheet Link: http://www.farnell.com/datasheets/746258.pdf; Height: 0.95mm; Manufacturer_Part_Number: EMK107B7104KA-T; Mouser Part Number: 963-EMK107B7104KA-T; Arrow Part Number: EMK107B7104KA-T; Arrow Price/Stock: https://www.arrow.com/en/products/emk107b7104ka-t/taiyo-yuden
  C33 C94 C95: Mouser Price/Stock: https://www.mouser.co.uk/ProductDetail/TAIYO-YUDEN/EMK107B7104KA-T?qs=I6KAKw0tg2ybqzX8hKPgfw%3D%3D
  C75 C76 C80 C86 C88: Mouser Price/Stock: https://www.mouser.co.uk/ProductDetail/Taiyo-Yuden/EMK107B7104KA-T?qs=I6KAKw0tg2ybqzX8hKPgfw%3D%3D
C69 C112 C114-C117 = C1206C102KGRACAUTO: as C99 on sheet Analogicas_Tension; Datasheet Link: https://content.kemet.com/datasheets/KEM_C1076_X7R_HV_AUTO_SMD.pdf; Manufacturer_Part_Number: C1206C102KGRACAUTO; Mouser Part Number: 80-C1206C102KGRAUTO; Mouser Price/Stock: https://www.mouser.co.uk/ProductDetail/KEMET/C1206C102KGRACAUTO?qs=02kMkzikyGKenJNcwYLRQw%3D%3D; Arrow Part Number: C1206C102KGRACAUTO; Arrow Price/Stock: https://www.arrow.com/en/products/c1206c102kgracauto/kemet-corporation?region=nac
C108 C111 = LDEQD1100KA5N00: as C98 on sheet Analogicas_Tension; Datasheet Link: https://content.kemet.com/datasheets/KEM_F3078_LDE.pdf; Height: 1.9mm; Manufacturer_Part_Number: LDEQD1100KA5N00; Mouser Part Number: 80-LDEQD1100KA5N00; Mouser Price/Stock: https://www.mouser.co.uk/ProductDetail/KEMET/LDEQD1100KA5N00?qs=MdJgNetHbfkxq2yA6XdGCw%3D%3D
D6 D7 = CM1293A-04SO: as D4 on sheet Analogicas_Tension; Datasheet Link: https://www.onsemi.com/pub/Collateral/CM1293A-04SO-D.PDF; Height: 1.1mm; Mouser Part Number: 748-CM1293A-04SO; Mouser Price/Stock: https://www.mouser.co.uk/ProductDetail/onsemi/CM1293A-04SO?qs=LMMkZCEv%2Ff0mlcOKTEwKBg%3D%3D; Arrow Part Number: CM1293A-04SO; Arrow Price/Stock: https://www.arrow.com/en/products/cm1293a-04so/on-semiconductor?region=nac
R6 R10 = ERJ-S03F6802V: Resistor; Manufacturer_Name: Panasonic; Datasheet Link: https://industrial.panasonic.com/cdbs/www-data/pdf/RDP0000/AOA0000C334.pdf; Height: 0.55mm; Manufacturer_Part_Number: ERJ-S03F6802V; Mouser Part Number: 667-ERJ-S03F6802V; Mouser Price/Stock: https://www.mouser.co.uk/ProductDetail/Panasonic/ERJ-S03F6802V?qs=Zyl8A9hlmJrefgHdaBD9Yg%3D%3D
  R10: Value: 68 kOhm - 1/10 W
R7 R9 = CRCW06036K80FKEA: Resistor; Manufacturer_Name: Vishay; Datasheet Link: http://www.vishay.com/docs/20035/dcrcwe3.pdf; Height: 0.5mm; Manufacturer_Part_Number: CRCW06036K80FKEA; Mouser Part Number: 71-CRCW0603-6.8K-E3; Mouser Price/Stock: https://www.mouser.co.uk/ProductDetail/Vishay-Dale/CRCW06036K80FKEA?qs=AJ8X0UdFcuT%2FTCHOUTZCrw%3D%3D; Arrow Part Number: CRCW06036K80FKEA; Arrow Price/Stock: https://www.arrow.com/en/products/crcw06036k80fkea/vishay
R8 R11 = CRCW060318K0FKEA: Resistor; Manufacturer_Name: Vishay; Datasheet Link: http://www.vishay.com/docs/20035/dcrcwe3.pdf; Height: 0.5mm; Manufacturer_Part_Number: CRCW060318K0FKEA; Mouser Part Number: 71-CRCW0603-18K-E3; Mouser Price/Stock: https://www.mouser.co.uk/ProductDetail/Vishay-Dale/CRCW060318K0FKEA?qs=Ihd9YkxhV%2F2Qiuqr%2FyuzaQ%3D%3D; Arrow Part Number: CRCW060318K0FKEA; Arrow Price/Stock: https://www.arrow.com/en/products/crcw060318k0fkea/vishay?region=nac
R15 R16 = CRCW060347K0FKEAHP: Resistor; Manufacturer_Name: Vishay; Datasheet Link: http://www.farnell.com/datasheets/1885357.pdf; Height: 0.5mm; Manufacturer_Part_Number: CRCW060347K0FKEAHP; Mouser Part Number: 71-CRCW060347K0FKEAH; Mouser Price/Stock: https://www.mouser.co.uk/ProductDetail/Vishay-Dale/CRCW060347K0FKEAHP?qs=k2%2FDWSARqgGdf8xU6XXKnw%3D%3D; Arrow Part Number: CRCW060347K0FKEAHP; Arrow Price/Stock: https://www.arrow.com/en/products/crcw060347k0fkeahp/vishay?region=nac
R17 R19 R31 R35 = CRCW060339K0FKEA: Resistor; Manufacturer_Name: Vishay; Datasheet Link: http://www.vishay.com/docs/20035/dcrcwe3.pdf; Height: 0.5mm; Manufacturer_Part_Number: CRCW060339K0FKEA; Mouser Part Number: 71-CRCW0603-39K-E3; Mouser Price/Stock: https://www.mouser.co.uk/ProductDetail/Vishay-Dale/CRCW060339K0FKEA?qs=LdkvS58n%252BakpUVpOJpUwUw%3D%3D; Arrow Part Number: CRCW060339K0FKEA; Arrow Price/Stock: https://www.arrow.com/en/products/crcw060339k0fkea/vishay
R21 R55 = CRG0603F8K2: Resistor; Manufacturer_Name: TE Connectivity; Datasheet Link: https://www.te.com/commerce/DocumentDelivery/DDEController?Action=srchrtrv&DocNm=1773204&DocType=Data%20Sheet&DocLang=English&PartCntxt=1623004-1&DocFormat=pdf; Height: 0.55mm; Manufacturer_Part_Number: CRG0603F8K2; Mouser Part Number: 279-CRG0603F8K2; Mouser Price/Stock: https://www.mouser.com/Search/Refine.aspx?Keyword=279-CRG0603F8K2; Arrow Part Number: CRG0603F8K2; Arrow Price/Stock: https://www.arrow.com/en/products/crg0603f8k2/te-connectivity
R26 R30 = CRCW060315K0FKEAC: Resistor; Manufacturer_Name: Vishay; Datasheet Link: https://www.arrow.com/en/products/crcw060315k0fkeac/vishay; Height: 0.55mm; Manufacturer_Part_Number: CRCW060315K0FKEAC; Mouser Part Number: 71-CRCW060315K0FKEAC; Mouser Price/Stock: https://www.mouser.co.uk/ProductDetail/Vishay-Dale/CRCW060315K0FKEAC?qs=E3Y5ESvWgWOCeZLgjE8pIw%3D%3D; Arrow Part Number: CRCW060315K0FKEAC; Arrow Price/Stock: https://www.arrow.com/en/products/crcw060315k0fkeac/vishay?region=nac
R27 R29 = CRCW06031K00FKEAC: Resistor; Manufacturer_Name: Vishay; Datasheet Link: https://www.vishay.com/docs/28773/crcwce3.pdf; Height: 0.55mm; Manufacturer_Part_Number: CRCW06031K00FKEAC; Mouser Part Number: 71-CRCW06031K00FKEAC; Mouser Price/Stock: https://www.mouser.co.uk/ProductDetail/Vishay-Dale/CRCW06031K00FKEAC?qs=E3Y5ESvWgWOQ7ePIWbGVFg%3D%3D; Arrow Part Number: CRCW06031K00FKEAC; Arrow Price/Stock: https://www.arrow.com/en/products/crcw06031k00fkeac/vishay?region=nac
R32 R34 = CRCW06031K80FKEAC: Resistor; Manufacturer_Name: Vishay; Datasheet Link: http://www.vishay.com/docs/28773/crcwce3.pdf; Height: 0.55mm; Manufacturer_Part_Number: CRCW06031K80FKEAC; Mouser Part Number: 71-CRCW06031K80FKEAC; Mouser Price/Stock: https://www.mouser.co.uk/ProductDetail/Vishay-Dale/CRCW06031K80FKEAC?qs=E3Y5ESvWgWO9QbyRuawq%2Fw%3D%3D; Arrow Part Number: CRCW06031K80FKEAC; Arrow Price/Stock: https://www.arrow.com/en/products/crcw06031k80fkeac/vishay
R33 R36 R106 = CRCW060310K0FKEA: Resistor; Manufacturer_Name: Vishay; Datasheet Link: http://www.vishay.com/docs/20035/dcrcwe3.pdf; Height: 0.5mm; Manufacturer_Part_Number: CRCW060310K0FKEA; Mouser Part Number: 71-CRCW0603-10K-E3; Mouser Price/Stock: https://www.mouser.co.uk/ProductDetail/Vishay-Dale/CRCW060310K0FKEA?qs=pAO1Z172M84BVnhDjtnsoQ%3D%3D; Arrow Part Number: CRCW060310K0FKEA; Arrow Price/Stock: https://www.arrow.com/en/products/crcw060310k0fkea/vishay?region=nac
TP_IAC TP_IBRDG TP_IIN TP_IL1 = Test_Point: as TP_VAC on sheet Analogicas_Tension
U5 U7 U9 = OPA2350UA_2K5: as U6 on sheet Analogicas_Tension; Datasheet Link: http://www.ti.com/lit/gpn/opa2350; Height: 1.75mm; Mouser Part Number: 595-OPA2350UA/2K5; Mouser Price/Stock: https://www.mouser.co.uk/ProductDetail/Texas-Instruments/OPA2350UA-2K5?qs=7nS3%252BbEUL6t75JUF5jEhbw%3D%3D; Arrow Part Number: OPA2350UA/2K5; Arrow Price/Stock: https://www.arrow.com/en/products/opa2350ua2k5/texas-instruments?region=nac

## Sheet DriverSignals.SchDoc: Driver Signals
size A4; CompanyName: TM; DrawnBy: Juan Tinazzo; Revision: R8; SheetNumber: 6; SheetTotal: 7; Number: CB_DRV
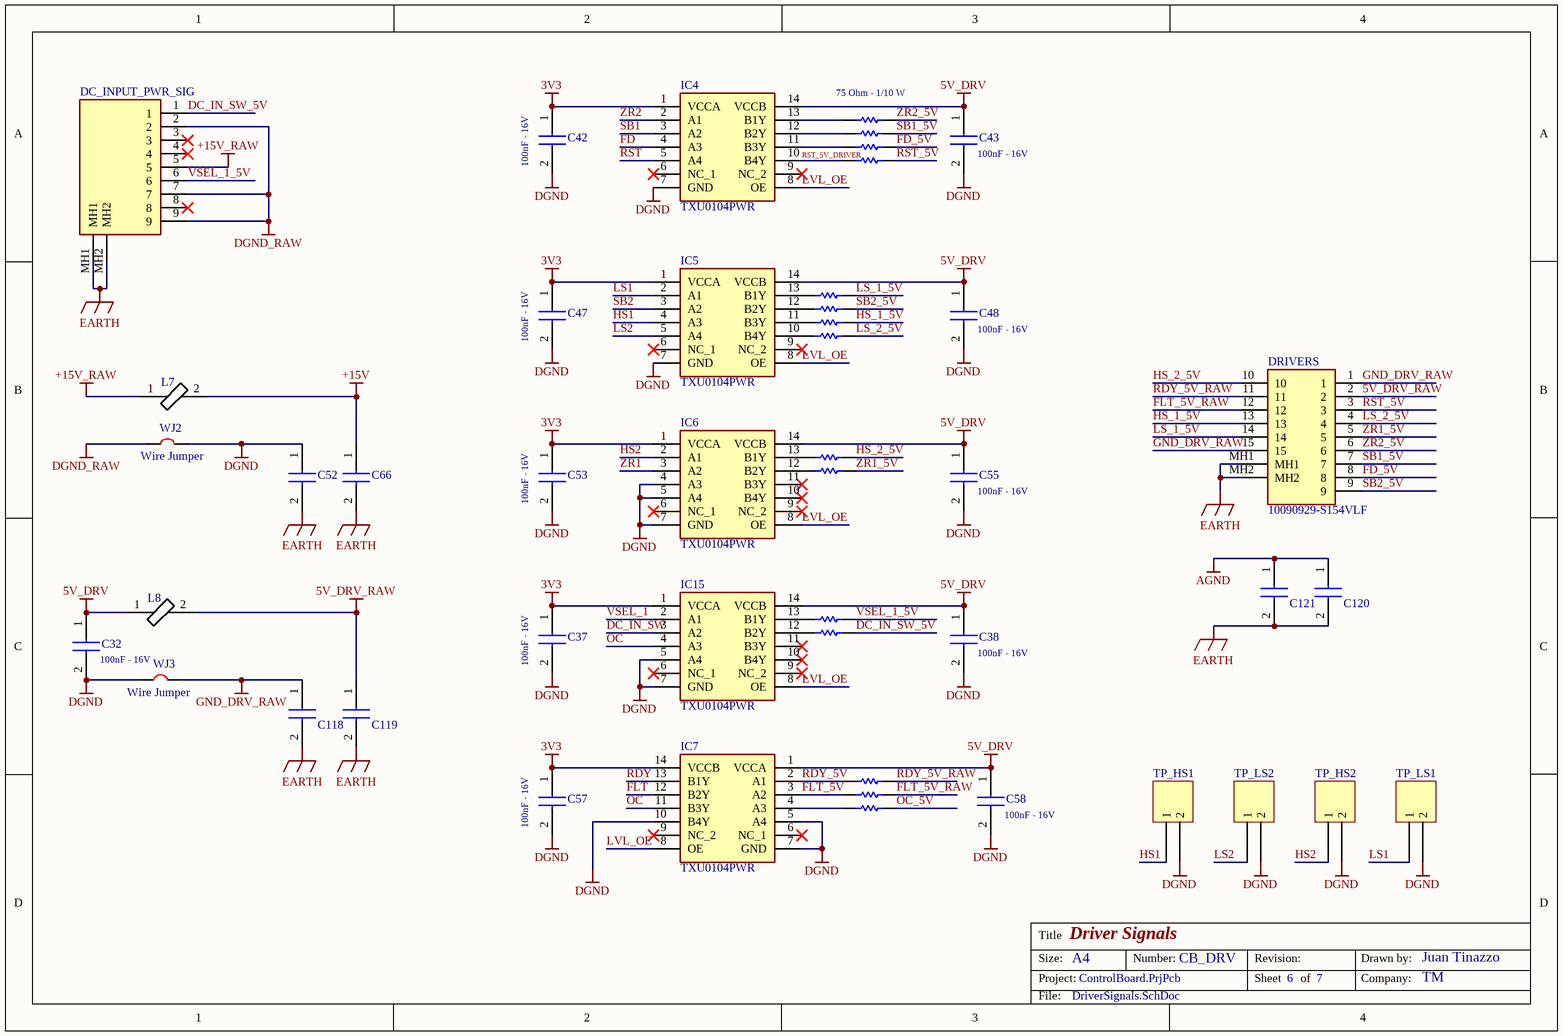
[diagram p5: DriverSignals.SchDoc]

### Parts
C32  value 100nF - 16V  [CAPC1608X95N]  (hidden comment: 100n 16V 0603)
C37  value 100nF - 16V  [CAPC1608X95N]  (hidden comment: 100n 16V 0603)
C38  value 100nF - 16V  [CAPC1608X95N]  (hidden comment: 100n 16V 0603)
C42  value 100nF - 16V  [CAPC1608X95N]  (hidden comment: 100n 16V 0603)
C43  value 100nF - 16V  [CAPC1608X95N]  (hidden comment: 100n 16V 0603)
C47  value 100nF - 16V  [CAPC1608X95N]  (hidden comment: 100n 16V 0603)
C48  value 100nF - 16V  [CAPC1608X95N]  (hidden comment: 100n 16V 0603)
C52  LDEQD1100KA5N00  [C_2220_1206]  (value not drawn)
C53  value 100nF - 16V  [CAPC1608X95N]  (hidden comment: 100n 16V 0603)
C55  value 100nF - 16V  [CAPC1608X95N]  (hidden comment: 100n 16V 0603)
C57  value 100nF - 16V  [CAPC1608X95N]  (hidden comment: 100n 16V 0603)
C58  value 100nF - 16V  [CAPC1608X95N]  (hidden comment: 100n 16V 0603)
C66  LDEQD1100KA5N00  [C_2220_1206]  (value not drawn)
C118  C1206C102KGRACAUTO  [C1206]  (value not drawn)
C119  C1206C102KGRACAUTO  [C1206]  (value not drawn)
C120  C1206C102KGRACAUTO  [C1206]  (value not drawn)
C121  C1206C102KGRACAUTO  [C1206]  (value not drawn)
DC_INPUT_PWR_SIG  L77TSEH09SOL2RM8  [L77TSEH09SOL2RM8]  (value not drawn)
DRIVERS  10090929-S154VLF  [10090929S154VLF]
IC4  TXU0104PWR  [SOP65P640X120-14N]
IC5  TXU0104PWR  [SOP65P640X120-14N]
IC6  TXU0104PWR  [SOP65P640X120-14N]
IC7  TXU0104PWR  [SOP65P640X120-14N]
IC15  TXU0104PWR  [SOP65P640X120-14N]
L7  78279220601  [BEADC2012X110N]  (value not drawn)
L8  78279220601  [BEADC2012X110N]  (value not drawn)
R43  value 75 Ohm - 1/10 W  [RESC1608X55N]  (hidden comment: CRCW060375R0FKEAC)
R44  CRCW060375R0FKEAC  [RESC1608X55N]  (value not drawn)
R45  CRCW060375R0FKEAC  [RESC1608X55N]  (value not drawn)
R46  CRCW060375R0FKEAC  [RESC1608X55N]  (value not drawn)
R47  CRCW060375R0FKEAC  [RESC1608X55N]  (value not drawn)
R49  CRCW060375R0FKEAC  [RESC1608X55N]  (value not drawn)
R50  CRCW060375R0FKEAC  [RESC1608X55N]  (value not drawn)
R51  CRCW060375R0FKEAC  [RESC1608X55N]  (value not drawn)
R56  CRCW060375R0FKEAC  [RESC1608X55N]  (value not drawn)
R57  CRCW060375R0FKEAC  [RESC1608X55N]  (value not drawn)
R58  CRCW060375R0FKEAC  [RESC1608X55N]  (value not drawn)
R59  CRCW060375R0FKEAC  [RESC1608X55N]  (value not drawn)
R102  CRCW060375R0FKEAC  [RESC1608X55N]  (value not drawn)
R103  CRCW060375R0FKEAC  [RESC1608X55N]  (value not drawn)
R104  CRCW060375R0FKEAC  [RESC1608X55N]  (value not drawn)
TP_HS1  Test_Point  [Test Point]  (value not drawn)
TP_HS2  Test_Point  [Test Point]  (value not drawn)
TP_LS1  Test_Point  [Test Point]  (value not drawn)
TP_LS2  Test_Point  [Test Point]  (value not drawn)
WJ2  Wire Jumper  (net tie, no BOM)
WJ3  Wire Jumper  (net tie, no BOM)

### Nets
3V3: C37.1 C42.1 C47.1 C53.1 C57.1 IC4.1(VCCA) IC5.1(VCCA) IC6.1(VCCA) IC7.14(VCCB) IC15.1(VCCA)
5V_DRV: C32.1 C38.1 C43.1 C48.1 C55.1 C58.1 IC4.14(VCCB) IC5.14(VCCB) IC6.14(VCCB) IC7.1(VCCA) IC15.14(VCCB) L8.1
5V_DRV_RAW: C119.1 DRIVERS.2 L8.2
+15V: C66.1 L7.2
+15V_RAW: DC_INPUT_PWR_SIG.5 L7.1
AGND: C32.2 C37.2 C38.2 C42.2 C43.2 C47.2 C48.2 C52.1 C53.2 C55.2 C57.2 C58.2 C120.1 C121.1 IC4.7(GND) IC5.7(GND) IC6.4(A3) IC6.5(A4) IC6.7(GND) IC7.5(A4) IC7.7(GND) IC7.10(B4Y) IC15.5(A4) IC15.7(GND) TP_HS1.2 TP_HS2.2 TP_LS1.2 TP_LS2.2 WJ2.1 WJ3.0  [also labelled DGND]
DGND_RAW: DC_INPUT_PWR_SIG.2 DC_INPUT_PWR_SIG.7 DC_INPUT_PWR_SIG.9 WJ2.0
EARTH: C52.2 C66.2 C118.2 C119.2 C120.2 C121.2 DC_INPUT_PWR_SIG.MH1 DC_INPUT_PWR_SIG.MH2 DRIVERS.MH1 DRIVERS.MH2
GND_DRV_RAW: C118.1 DRIVERS.1 DRIVERS.15 WJ3.1
DC_IN_SW: IC15.3(A2)
DC_IN_SW_5V: DC_INPUT_PWR_SIG.1 R103.2
FD: IC4.4(A3)
FD_5V: DRIVERS.8 R45.2
FLT: IC7.12(B2Y)
FLT_5V: IC7.3(A2) R59.1
FLT_5V_RAW: DRIVERS.12 R59.2
HS1: IC5.4(A3) TP_HS1.1
HS2: IC6.2(A1) TP_HS2.1
HS_1_5V: DRIVERS.13 R50.2
HS_2_5V: DRIVERS.10 R56.2
LS1: IC5.2(A1) TP_LS1.1
LS2: IC5.5(A4) TP_LS2.1
LS_1_5V: DRIVERS.14 R47.2
LS_2_5V: DRIVERS.4 R51.2
LVL_OE: IC4.8(OE) IC5.8(OE) IC6.8(OE) IC7.8(OE) IC15.8(OE)
OC: IC7.11(B3Y) IC15.4(A3)
OC_5V: R104.2
RDY: IC7.13(B1Y)
RDY_5V: IC7.2(A1) R58.1
RDY_5V_RAW: DRIVERS.11 R58.2
RST: IC4.5(A4)
RST_5V: DRIVERS.3 R46.2
RST_5V_DRIVER: IC4.10(B4Y) R46.1
SB1: IC4.3(A2)
SB1_5V: DRIVERS.7 R44.2
SB2: IC5.3(A2)
SB2_5V: DRIVERS.9 R49.2
VSEL_1: IC15.2(A1)
VSEL_1_5V: DC_INPUT_PWR_SIG.6 R102.2
ZR1: IC6.3(A2)
ZR1_5V: DRIVERS.5 R57.2
ZR2: IC4.2(A1)
ZR2_5V: DRIVERS.6 R43.2
NetIC4_11: IC4.11(B3Y) R45.1
NetIC4_12: IC4.12(B2Y) R44.1
NetIC4_13: IC4.13(B1Y) R43.1
NetIC5_10: IC5.10(B4Y) R51.1
NetIC5_11: IC5.11(B3Y) R50.1
NetIC5_12: IC5.12(B2Y) R49.1
NetIC5_13: IC5.13(B1Y) R47.1
NetIC6_12: IC6.12(B2Y) R57.1
NetIC6_13: IC6.13(B1Y) R56.1
NetIC7_4: IC7.4(A3) R104.1
NetIC15_12: IC15.12(B2Y) R103.1
NetIC15_13: IC15.13(B1Y) R102.1

Not connected (* = marked no-connect by the designer): DC_INPUT_PWR_SIG 3* 4* 8*; IC4 6(NC_1)* 9(NC_2)*; IC5 6(NC_1)* 9(NC_2)*; IC6 6(NC_1)* 9(NC_2)* 10(B4Y)* 11(B3Y)*; IC7 6(NC_1)* 9(NC_2)*; IC15 6(NC_1)* 9(NC_2)* 10(B4Y)* 11(B3Y)*

### Notes on the sheet
- OC en PIN 4 quedó por un arreglo
- Title
- Size:
- Project:
- A4
- Number:
- Revision:
- Sheet
- of
- Drawn by:
- Company:
- File:

### Library data of the parts
C32 C37 C38 C42 C43 C47 C48 C53 C55 C57 C58 = EMK107B7104KA-T: as C36 on sheet Analogicas_Tension; Datasheet Link: http://www.farnell.com/datasheets/746258.pdf; Height: 0.95mm; Manufacturer_Part_Number: EMK107B7104KA-T; Mouser Part Number: 963-EMK107B7104KA-T; Mouser Price/Stock: https://www.mouser.co.uk/ProductDetail/Taiyo-Yuden/EMK107B7104KA-T?qs=I6KAKw0tg2ybqzX8hKPgfw%3D%3D; Arrow Part Number: EMK107B7104KA-T; Arrow Price/Stock: https://www.arrow.com/en/products/emk107b7104ka-t/taiyo-yuden
C52 C66 = LDEQD1100KA5N00: as C98 on sheet Analogicas_Tension; Datasheet Link: https://content.kemet.com/datasheets/KEM_F3078_LDE.pdf; Height: 1.9mm; Manufacturer_Part_Number: LDEQD1100KA5N00; Mouser Part Number: 80-LDEQD1100KA5N00; Mouser Price/Stock: https://www.mouser.co.uk/ProductDetail/KEMET/LDEQD1100KA5N00?qs=MdJgNetHbfkxq2yA6XdGCw%3D%3D
C118-C121 = C1206C102KGRACAUTO: as C99 on sheet Analogicas_Tension; Datasheet Link: https://content.kemet.com/datasheets/KEM_C1076_X7R_HV_AUTO_SMD.pdf; Manufacturer_Part_Number: C1206C102KGRACAUTO; Mouser Part Number: 80-C1206C102KGRAUTO; Mouser Price/Stock: https://www.mouser.co.uk/ProductDetail/KEMET/C1206C102KGRACAUTO?qs=02kMkzikyGKenJNcwYLRQw%3D%3D; Arrow Part Number: C1206C102KGRACAUTO; Arrow Price/Stock: https://www.arrow.com/en/products/c1206c102kgracauto/kemet-corporation?region=nac
DC_INPUT_PWR_SIG = L77TSEH09SOL2RM8: as AC_OUTPUT_AN on sheet Analogicas_Tension; Datasheet Link: https://cdn.amphenol-cs.com/media/wysiwyg/files/drawing/l77tsxhxxsol2rm8.pdf; Height: 12.3mm; Manufacturer_Part_Number: L77TSEH09SOL2RM8; Mouser Part Number: 523-L77TSEH09SOL2RM8; Mouser Price/Stock: https://www.mouser.co.uk/ProductDetail/Amphenol-Commercial-Products/L77TSEH09SOL2RM8?qs=mq7kV%2Fq8lk5RvjourI%2Fduw%3D%3D; Arrow Part Number: L77TSEH09SOL2RM8; Arrow Price/Stock: https://www.arrow.com/en/products/l77tseh09sol2rm8/amphenol-fci?region=nac; System: Connector
DRIVERS = 10090929-S154VLF: Connector; Manufacturer_Name: Amphenol Communications Solutions; Value: Conectores de alta densidad subminiatura D 15P; Datasheet Link: https://cdn.amphenol-cs.com/media/wysiwyg/files/drawing/10090929.pdf; Height: 12.4mm; Manufacturer_Part_Number: 10090929-S154VLF; Mouser Part Number: 649-10090929-S154VLF; System: Connector
IC4-IC7 IC15 = TXU0104PWR: Integrated Circuit; Manufacturer_Name: Texas Instruments; Value: Four channel unidirectional level shifter; Datasheet Link: https://www.ti.com/lit/ds/symlink/txu0104.pdf?ts=1625451640473&ref_url=https%253A%252F%252Fwww.ti.com%252Fsitesearch%252Fdocs%252Funiversalsearch.tsp%253FlangPref%253Den-US%2526searchTerm%253DTXU0104PWR%2526nr%253D4; Height: 1.2mm; Manufacturer_Part_Number: TXU0104PWR; Mouser Part Number: 595-TXU0104PWR; Mouser Price/Stock: https://www.mouser.co.uk/ProductDetail/Texas-Instruments/TXU0104PWR?qs=QNEnbhJQKvYcSGbLlthvAQ%3D%3D; Arrow Part Number: TXU0104PWR; Arrow Price/Stock: https://www.arrow.com/en/products/txu0104pwr/texas-instruments?region=nac
L7 L8 = 78279220601: as L3 on sheet Analogicas_Tension; Datasheet Link: https://www.mouser.de/datasheet/2/445/78279220601-2298574.pdf; Height: 1.1mm; Manufacturer_Part_Number: 78279220601; Mouser Part Number: 710-78279220601; Mouser Price/Stock: https://www.mouser.co.uk/ProductDetail/Wurth-Elektronik/78279220601?qs=iLbezkQI%252BsjgiK1FovJqGg%3D%3D
R43 = CRCW060375R0FKEAC: Resistor; Manufacturer_Name: Vishay; Datasheet Link: https://www.arrow.com/en/products/crcw060375r0fkeac/vishay; Height: 0.55mm; Manufacturer_Part_Number: CRCW060375R0FKEAC; Mouser Part Number: 71-CRCW060375R0FKEAC; Mouser Price/Stock: https://www.mouser.co.uk/ProductDetail/Vishay-Dale/CRCW060375R0FKEAC?qs=E3Y5ESvWgWPOxF9wqCfv4A%3D%3D; Arrow Part Number: CRCW060375R0FKEAC; Arrow Price/Stock: https://www.arrow.com/en/products/crcw060375r0fkeac/vishay?region=nac
R44-R47 R49-R51 R56-R59 R102-R104 = CRCW060375R0FKEAC: Resistor; Manufacturer_Name: Vishay; Value: 75 Ohm - 1/10 W; Datasheet Link: https://www.arrow.com/en/products/crcw060375r0fkeac/vishay; Height: 0.55mm; Manufacturer_Part_Number: CRCW060375R0FKEAC; Mouser Part Number: 71-CRCW060375R0FKEAC; Mouser Price/Stock: https://www.mouser.co.uk/ProductDetail/Vishay-Dale/CRCW060375R0FKEAC?qs=E3Y5ESvWgWPOxF9wqCfv4A%3D%3D; Arrow Part Number: CRCW060375R0FKEAC; Arrow Price/Stock: https://www.arrow.com/en/products/crcw060375r0fkeac/vishay?region=nac
TP_HS1 TP_HS2 TP_LS1 TP_LS2 = Test_Point: as TP_VAC on sheet Analogicas_Tension
WJ2 WJ3 = Wire Jumper: Manufacturer_Part_Number: Wire